# Altium schematic sheet 4.SENSOR.SchDoc
size A4; SheetNumber: 4; SheetTotal: 5
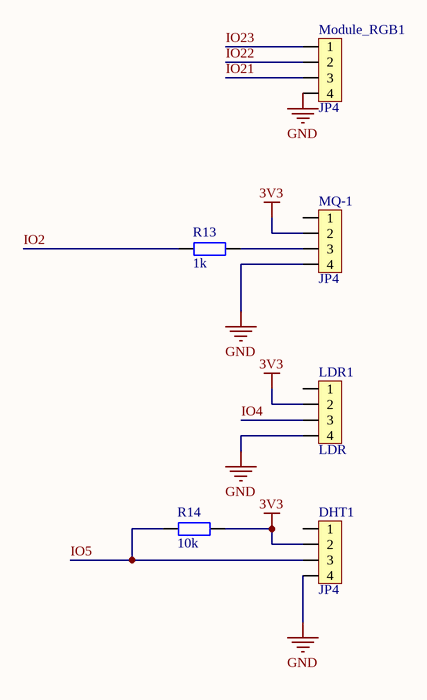
[diagram p0: 4.SENSOR.SchDoc]

## Parts
DHT1  JP4  [JP4-C1T]
LDR1  LDR  [JP4-C1T]
Module_RGB1  JP4  [JP4-C1T]
MQ-1  JP4  [JP4-C1T]
R13  1k  [RES-SMD-0805]
R14  10k  [RES-SMD-0805]

## Nets
3V3: DHT1.2 LDR1.2 MQ-1.2 R14.1
GND: DHT1.4 LDR1.4 Module_RGB1.4 MQ-1.4
IO2: R13.2
IO4: LDR1.3
IO5: DHT1.3 R14.2
IO21: Module_RGB1.3
IO22: Module_RGB1.2
IO23: Module_RGB1.1
NetMQ-1_3: MQ-1.3 R13.1

Not connected (* = marked no-connect by the designer): DHT1 1; LDR1 1; MQ-1 1

## Library data of the parts
DHT1 LDR1 Module_RGB1 MQ-1 = JP4: WR-PHD 2.54 mm Angled Socket Header; Manufacturer: W¨¹rth Elektronik eiSos GmbH; partNo: 613004143121; ComponentLink1 Description: Manufacturer; ComponentLink2 Description: Datasheet; NoPins: 04; Created Date: 29 March 2013; ComponentLink1URL: http://www.we-online.com; ComponentLink2URL: http://katalog.we-online.de/em/datasheet/6130xx143121.pdf; Created by: Karrer Zheng
R13 = Resistor - SMD: Manufacturer: Generic Components; Class: Passive; Published: 08/06/2000; Publisher: Altium Hobart Technology Centre
R14 = Resistor - SMD: 1k; Manufacturer: Generic Components; Class: Passive; Published: 08/06/2000; Publisher: Altium Hobart Technology Centre